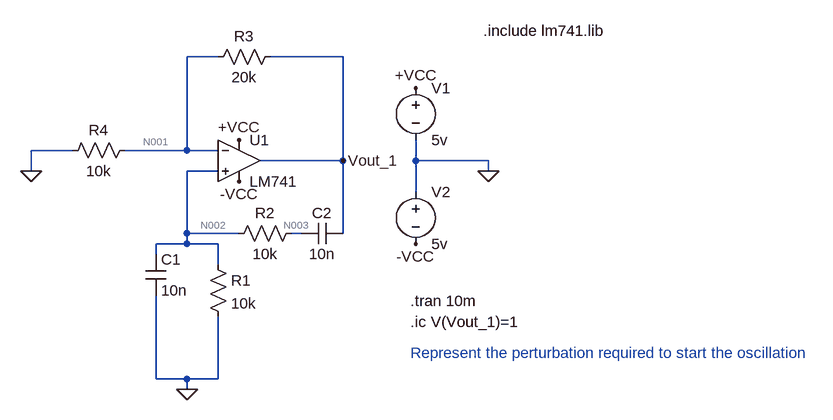
[diagram p0: schematic sim.asc]
sim.asc, the LTspice schematic file:
Version 4
SHEET 1 1224 1140
WIRE 240 16 192 16
WIRE 432 16 320 16
WIRE 16 160 -48 160
WIRE 192 160 192 16
WIRE 192 160 96 160
WIRE 240 160 192 160
WIRE 432 176 432 16
WIRE 432 176 304 176
WIRE 544 176 544 144
WIRE 656 176 544 176
WIRE -48 192 -48 160
WIRE 240 192 192 192
WIRE 656 192 656 176
WIRE 544 224 544 176
WIRE 192 288 192 192
WIRE 272 288 192 288
WIRE 368 288 352 288
WIRE 432 288 432 176
WIRE 192 304 192 288
WIRE 192 304 144 304
WIRE 240 304 192 304
WIRE 144 320 144 304
WIRE 240 336 240 304
WIRE 144 512 144 384
WIRE 192 512 144 512
WIRE 240 512 240 416
WIRE 240 512 192 512
WIRE 192 528 192 512
FLAG 656 192 0
FLAG 544 64 +VCC
FLAG 544 304 -VCC
FLAG 272 144 +VCC
FLAG 272 208 -VCC
FLAG -48 192 0
FLAG 432 176 Vout_1
FLAG 192 528 0
SYMBOL voltage 544 48 R0
WINDOW 123 0 0 Left 0
WINDOW 39 0 0 Left 0
SYMATTR InstName V1
SYMATTR Value 5v
SYMBOL voltage 544 208 R0
WINDOW 123 0 0 Left 0
WINDOW 39 0 0 Left 0
SYMATTR InstName V2
SYMATTR Value 5v
SYMBOL OpAmps\\opamp2 272 112 R0
SYMATTR InstName U1
SYMATTR Value LM741
SYMBOL cap 128 320 R0
SYMATTR InstName C1
SYMATTR Value 10n
SYMBOL res 224 320 R0
SYMATTR InstName R1
SYMATTR Value 10k
SYMBOL res 368 272 R90
WINDOW 0 0 56 VBottom 2
WINDOW 3 32 56 VTop 2
SYMATTR InstName R2
SYMATTR Value 10k
SYMBOL cap 432 272 R90
WINDOW 0 0 32 VBottom 2
WINDOW 3 32 32 VTop 2
SYMATTR InstName C2
SYMATTR Value 10n
SYMBOL res 336 0 R90
WINDOW 0 0 56 VBottom 2
WINDOW 3 32 56 VTop 2
SYMATTR InstName R3
SYMATTR Value 20k
SYMBOL res 112 144 R90
WINDOW 0 0 56 VBottom 2
WINDOW 3 32 56 VTop 2
SYMATTR InstName R4
SYMATTR Value 10k
TEXT 536 392 Left 2 !.tran 10m
TEXT 648 -24 Left 2 !.include lm741.lib
TEXT 536 424 Left 2 !.ic V(Vout_1)=1
TEXT 536 472 Left 2 ;Represent the perturbation required to start the oscillation

The netlist it stands for:
* sim.asc
V1 +VCC 0 5v
V2 0 -VCC 5v
XU1 N002 N001 +VCC -VCC Vout_1 LM741  ; pins In+ In- V+ V- OUT
C1 N002 0 10n
R1 N002 0 10k
R2 N003 N002 10k
C2 Vout_1 N003 10n
R3 Vout_1 N001 20k
R4 N001 0 10k
.tran 10m
.include lm741.lib
.ic V(Vout_1)=1
* Represent the perturbation required to start the oscillation
.backanno
.end

* Results of the author's LTspice run, read from the files saved beside the schematic
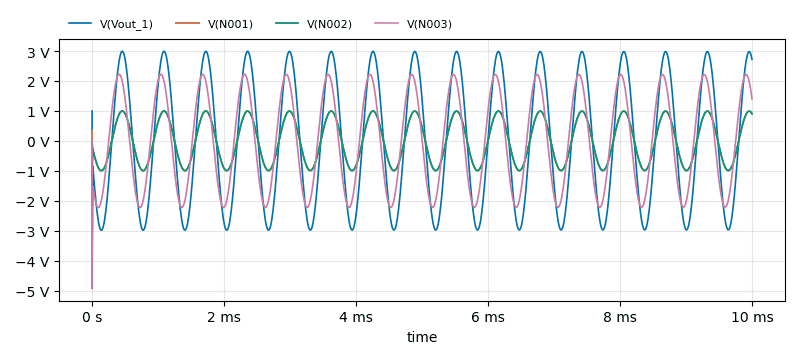
[diagram p1: Transient Analysis of sim.asc, plotted from the saved traces]
* Transient Analysis, 1 run:
*   V(Vout_1): min -3.953 V, max 2.994 V, average -15.67 mV, rms 2.118 V, last 2.723 V
*   V(N001): min -1.3 V, max 997.2 mV, average -5.892 mV, rms 705.9 mV, last 907 mV
*   V(N002): min -997.3 mV, max 996.3 mV, average -6.219 mV, rms 705.4 mV, last 904.1 mV
*   V(N003): min -4.944 V, max 2.224 V, average -2.891 mV, rms 1.581 V, last 1.398 V